# Altium schematic sheet UART_RS485.SchDoc: Access Control
size A; DrawnBy: Q.Thang & T.Khoa; Revision: V1.0.1; SheetNumber: 12; SheetTotal: 16
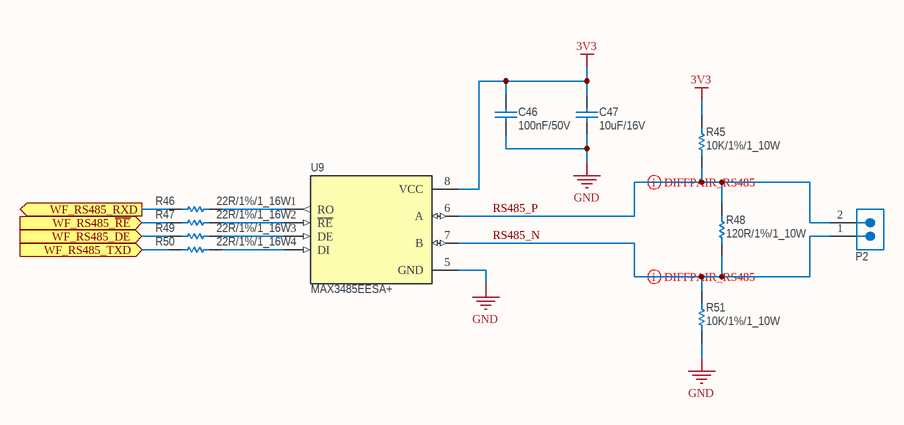
[diagram p0: UART_RS485.SchDoc]

## Parts
C46  100nF/50V  [CAP_0603]
C47  10uF/16V  [CAP_0603]
P2  3.81mm_2P  [Terminal_Block_3.81mm_2P]  (value not drawn)
R45  10K/1%/1_10W  [Resistor_0603]
R46  22R/1%/1_16W  [RESISTOR_0402]
R47  22R/1%/1_16W  [RESISTOR_0402]
R48  120R/1%/1_10W  [Resistor_0603]
R49  22R/1%/1_16W  [RESISTOR_0402]
R50  22R/1%/1_16W  [RESISTOR_0402]
R51  10K/1%/1_10W  [Resistor_0603]
U9  MAX3485EESA+  [SOIC-8]

## Ports
WF_RS485_DE (in, see Overview_Schematic[6B], ESP32_WiFi[3B]), WF_RS485_RXD (out, see Overview_Schematic[6B], ESP32_WiFi[3A]), WF_RS485_TXD (in, see Overview_Schematic[6B], ESP32_WiFi[3A]), WF_RS485_~{RE} (in, see Overview_Schematic[6B], ESP32_WiFi[3B])

## Nets
3V3: C46.2 C47.2 R45.2 U9.8(VCC)
GND: C46.1 C47.1 R51.2 U9.5(GND)
RS485_N: P2.1 R48.1 R51.1 U9.7(B)
RS485_P: P2.2 R45.1 R48.2 U9.6(A)
WF_RS485_DE: R49.1 ; port WF_RS485_DE
WF_RS485_~{RE}: R47.1 ; port WF_RS485_~{RE}
WF_RS485_RXD: R46.1 ; port WF_RS485_RXD
WF_RS485_TXD: R50.1 ; port WF_RS485_TXD
NetR46_2: R46.2 U9.1(RO)
NetR47_2: R47.2 U9.2(~{RE})
NetR49_2: R49.2 U9.3(DE)
NetR50_2: R50.2 U9.4(DI)

## Layout directives
differential pair: RS485_N, RS485_P

## Notes on the sheet
- Project Name
- Size
- A4
- Revision
- Checked By:
- Drawn By:
- Date:
- File:
- Last Modified:
- Sheet
- of

## Library data of the parts
C46 = Ceramic_Cap_100nF_50V_0603: CAP, size 0603, 100nF, 50V; Supply Part Number: Tụ Gốm 0603 100nF (0.1uF) 50V; Supply Name: Thegioiic; Datasheet: *; Supply URL: https://www.thegioiic.com/tu-gom-0603-100nf-0-1uf-50v
C47 = Ceramic_Cap_10uF_16V_0603: CAP, size 0603, 10uF, 16V; Supply Part Number: Tụ Gốm 0603 10uF 16V; Supply Name: Thegioiic; Datasheet: *; Supply URL: https://www.thegioiic.com/tu-gom-0603-10uf-16v
P2 = Terminal_Block_3.81mm_2P: Terminal Block THT, pitch 3.81mm, 2p, 300V, 10A; Supply Part Number: UL-3.81-2-R Terminal Block Plug-in Hàn PCB 2 Chân Cong 3.81mm 300V 10A ULO; Supply Name: Thegioiic; Supply URL: https://www.thegioiic.com/ul-3-81-2-r-terminal-block-plug-in-han-pcb-2-chan-cong-3-81mm-300v-10a-ulo
R45 R51 = Res_10K_0603_1%: Resistor 0603 10KOhm 1% 1_10W; Supply Part Number: Điện Trở 10 KOhm 0603 1%; Supply Name: Thegioiic; Supply URL: https://www.thegioiic.com/dien-tro-10-kohm-0603-1-
R46 R47 R49 R50 = Res_22R_0402_1%: Resistor 0402 22 Ohm 1% 1_16W; Supply Name: *; Supply Part Number: *; Supply URL: *
R48 = Res_120R_0603_1%: Resistor 0603 120 Ohm 1% 1_10W; Supply Part Number: Điện Trở 120 Ohm 0603 1%; Supply Name: Thegioiic; Supply URL: https://www.thegioiic.com/dien-tro-120-ohm-0603-1-
U9 = MAX3485EESA+: 1/1 Transceiver Half RS422, RS485 8-SOIC; Supply Part Number: MAX3485EESA+ Line Transceiver, 8-SOIC; Supply Name: Thegioiic; Datasheet: https://www.analog.com/media/en/technical-documentation/data-sheets/max3483e-max3491e.pdf; Supply URL: https://www.thegioiic.com/max3485eesa-line-transceiver-8-soic